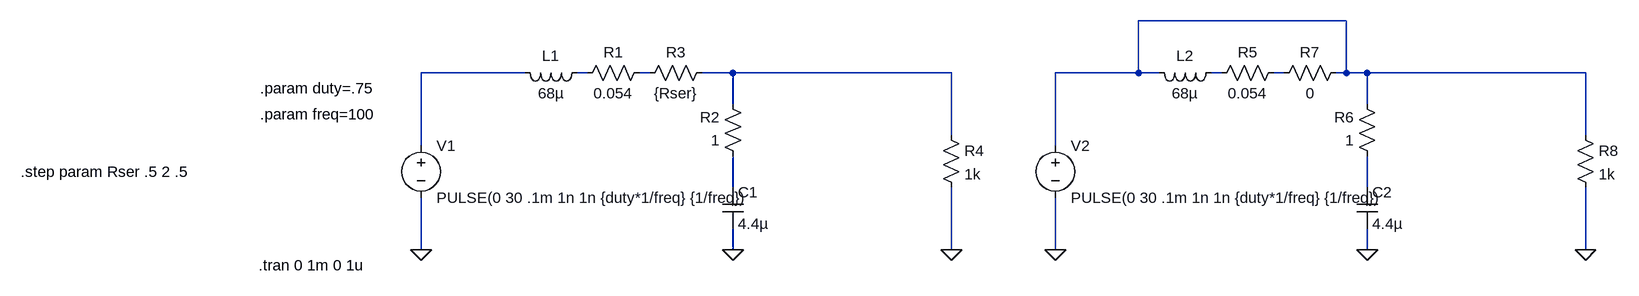
[diagram p0: schematic PWM LC Filter Overshoot.asc]
PWM LC Filter Overshoot.asc, the LTspice schematic file:
Version 4
SHEET 1 1864 680
WIRE 1440 -48 1120 -48
WIRE 176 32 16 32
WIRE 272 32 256 32
WIRE 368 32 352 32
WIRE 496 32 448 32
WIRE 832 32 496 32
WIRE 1120 32 1120 -48
WIRE 1120 32 992 32
WIRE 1152 32 1120 32
WIRE 1248 32 1232 32
WIRE 1344 32 1328 32
WIRE 1440 32 1440 -48
WIRE 1440 32 1424 32
WIRE 1472 32 1440 32
WIRE 1808 32 1472 32
WIRE 496 80 496 32
WIRE 1472 80 1472 32
WIRE 832 128 832 32
WIRE 1808 128 1808 32
WIRE 16 144 16 32
WIRE 992 144 992 32
WIRE 496 208 496 160
WIRE 1472 208 1472 160
WIRE 16 304 16 224
WIRE 496 304 496 272
WIRE 832 304 832 208
WIRE 992 304 992 224
WIRE 1472 304 1472 272
WIRE 1808 304 1808 208
FLAG 496 304 0
FLAG 16 304 0
FLAG 832 304 0
FLAG 1472 304 0
FLAG 992 304 0
FLAG 1808 304 0
SYMBOL voltage 16 128 R0
WINDOW 123 0 0 Left 0
WINDOW 39 0 0 Left 0
SYMATTR InstName V1
SYMATTR Value PULSE(0 30 .1m 1n 1n {duty*1/freq} {1/freq})
SYMBOL ind 272 16 R90
WINDOW 0 5 56 VBottom 2
WINDOW 3 32 56 VTop 2
SYMATTR InstName L1
SYMATTR Value 68µ
SYMBOL res 368 16 R90
WINDOW 0 0 56 VBottom 2
WINDOW 3 32 56 VTop 2
SYMATTR InstName R1
SYMATTR Value 0.054
SYMBOL res 512 176 R180
WINDOW 0 36 76 Left 2
WINDOW 3 36 40 Left 2
SYMATTR InstName R2
SYMATTR Value 1
SYMBOL cap 480 208 R0
SYMATTR InstName C1
SYMATTR Value 4.4µ
SYMBOL res 464 16 R90
WINDOW 0 0 56 VBottom 2
WINDOW 3 32 56 VTop 2
SYMATTR InstName R3
SYMATTR Value {Rser}
SYMBOL res 816 112 R0
SYMATTR InstName R4
SYMATTR Value 1k
SYMBOL voltage 992 128 R0
WINDOW 123 0 0 Left 0
WINDOW 39 0 0 Left 0
SYMATTR InstName V2
SYMATTR Value PULSE(0 30 .1m 1n 1n {duty*1/freq} {1/freq})
SYMBOL ind 1248 16 R90
WINDOW 0 5 56 VBottom 2
WINDOW 3 32 56 VTop 2
SYMATTR InstName L2
SYMATTR Value 68µ
SYMBOL res 1344 16 R90
WINDOW 0 0 56 VBottom 2
WINDOW 3 32 56 VTop 2
SYMATTR InstName R5
SYMATTR Value 0.054
SYMBOL res 1488 176 R180
WINDOW 0 36 76 Left 2
WINDOW 3 36 40 Left 2
SYMATTR InstName R6
SYMATTR Value 1
SYMBOL cap 1456 208 R0
SYMATTR InstName C2
SYMATTR Value 4.4µ
SYMBOL res 1440 16 R90
WINDOW 0 0 56 VBottom 2
WINDOW 3 32 56 VTop 2
SYMATTR InstName R7
SYMATTR Value 0
SYMBOL res 1792 112 R0
SYMATTR InstName R8
SYMATTR Value 1k
TEXT -232 96 Left 2 !.param freq=100
TEXT -234 328 Left 2 !.tran 0 1m 0 1u
TEXT -232 56 Left 2 !.param duty=.75
TEXT -600 184 Left 2 !.step param Rser .5 2 .5

The netlist it stands for:
* PWM LC Filter Overshoot.asc
V1 N002 0 PULSE(0 30 .1m 1n 1n {duty*1/freq} {1/freq})
L1 N003 N002 68µ
R1 N004 N003 0.054
R2 N008 N005 1
C1 N008 0 4.4µ
R3 N005 N004 {Rser}
R4 N005 0 1k
V2 N001 0 PULSE(0 30 .1m 1n 1n {duty*1/freq} {1/freq})
L2 N006 N001 68µ
R5 N007 N006 0.054
R6 N009 N001 1
C2 N009 0 4.4µ
R7 N001 N007 0
R8 N001 0 1k
.param freq=100
.tran 0 1m 0 1u
.param duty=.75
.step param Rser .5 2 .5
.backanno
.end